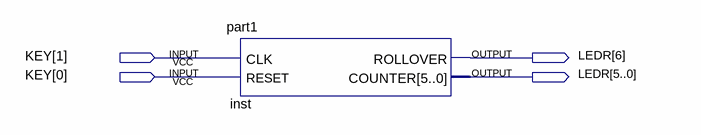
[diagram p0: schematic sheet]
// Quartus schematic part1_sch.bdf as structural Verilog: 1 symbols, 4 pins
module part1_sch (
  input  [1:0] KEY,
  output [6:0] LEDR
);

  part1 inst (.CLK(KEY[1]), .RESET(KEY[0]), .ROLLOVER(LEDR[6]), .COUNTER(LEDR[5:0]));
endmodule
